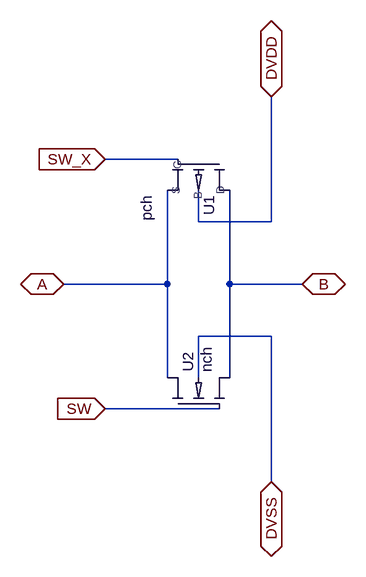
[diagram p0: schematic t_gate.asc]
t_gate.asc, the LTspice schematic file:
Version 4
SHEET 1 880 680
WIRE 208 -160 96 -160
WIRE 240 -64 240 -112
WIRE 352 -64 352 -256
WIRE 352 -64 240 -64
WIRE 192 32 192 -112
WIRE 192 32 32 32
WIRE 288 32 288 -112
WIRE 400 32 288 32
WIRE 352 112 240 112
WIRE 192 176 192 32
WIRE 240 176 240 112
WIRE 288 176 288 32
WIRE 272 224 96 224
WIRE 352 336 352 112
FLAG 352 -256 DVDD
IOPIN 352 -256 BiDir
FLAG 352 336 DVSS
IOPIN 352 336 BiDir
FLAG 32 32 A
IOPIN 32 32 BiDir
FLAG 400 32 B
IOPIN 400 32 BiDir
FLAG 96 224 SW
IOPIN 96 224 In
FLAG 96 -160 SW_X
IOPIN 96 -160 In
SYMBOL MPN 240 -128 R90
WINDOW 39 24 52 Left 2
WINDOW 3 24 80 Left 2
SYMATTR SpiceLine ""
SYMATTR Value pch
SYMATTR InstName U1
SYMATTR Prefix M
SYMATTR Value2 l=1u w=4u m=8
SYMBOL NMD4 192 224 R270
WINDOW 3 56 60 Left 2
WINDOW 38 56 88 Left 2
SYMATTR Value nch
SYMATTR InstName U2
SYMATTR Prefix M
SYMATTR Value2 l=1u w=1u m=8

The netlist it stands for:
* t_gate.asc
M§U1 B SW_X A DVDD pch l=1u w=4u m=8
M§U2 A SW B DVSS nch l=1u w=1u m=8
.model NMOS NMOS
.model PMOS PMOS
.lib standard.mos
.backanno
.end